# EAGLE board loa_v3.2 (EAGLE 6.5.0), part 1 of 2
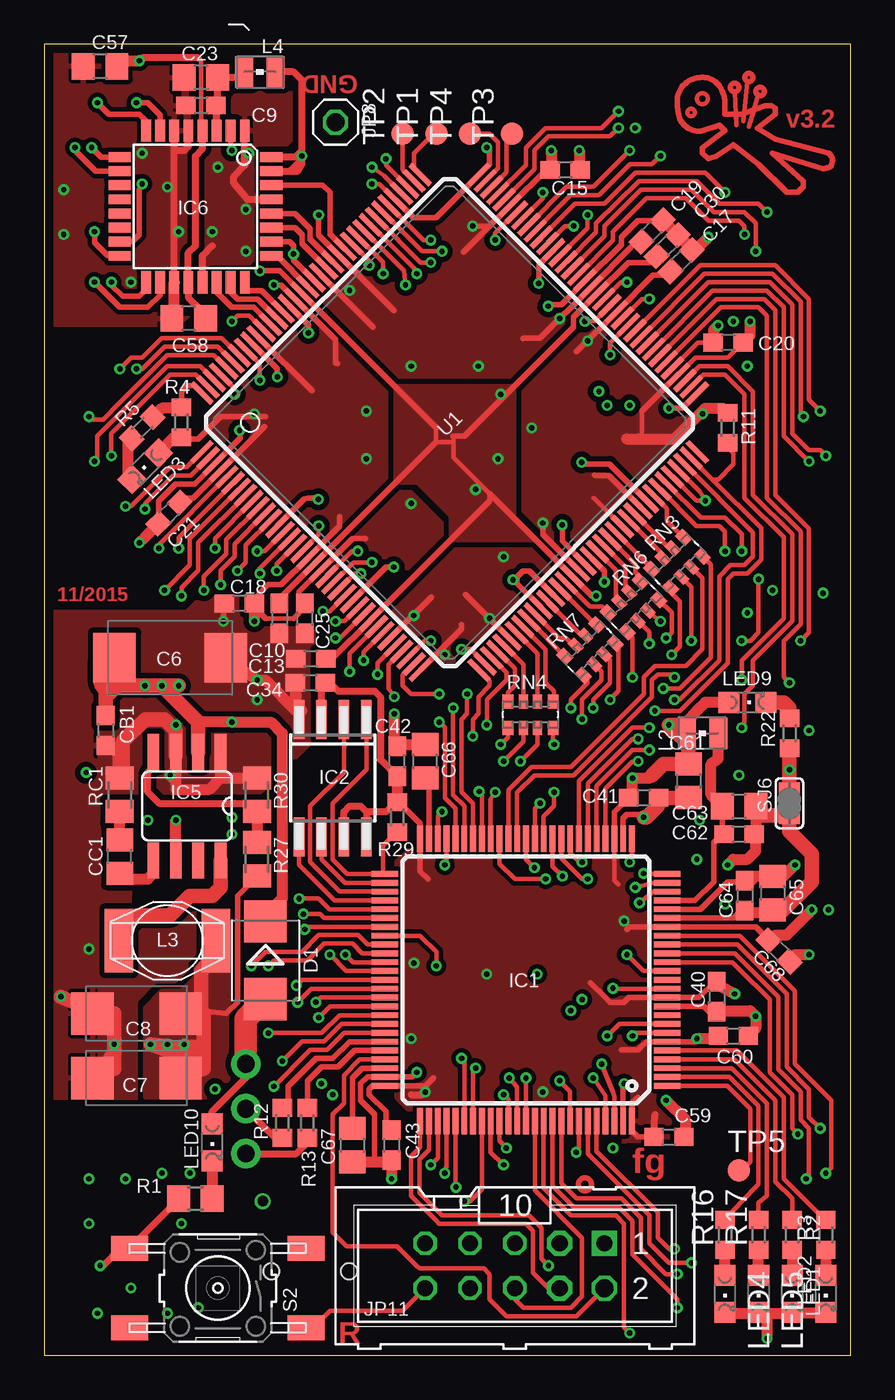
[diagram p7: board, top side]
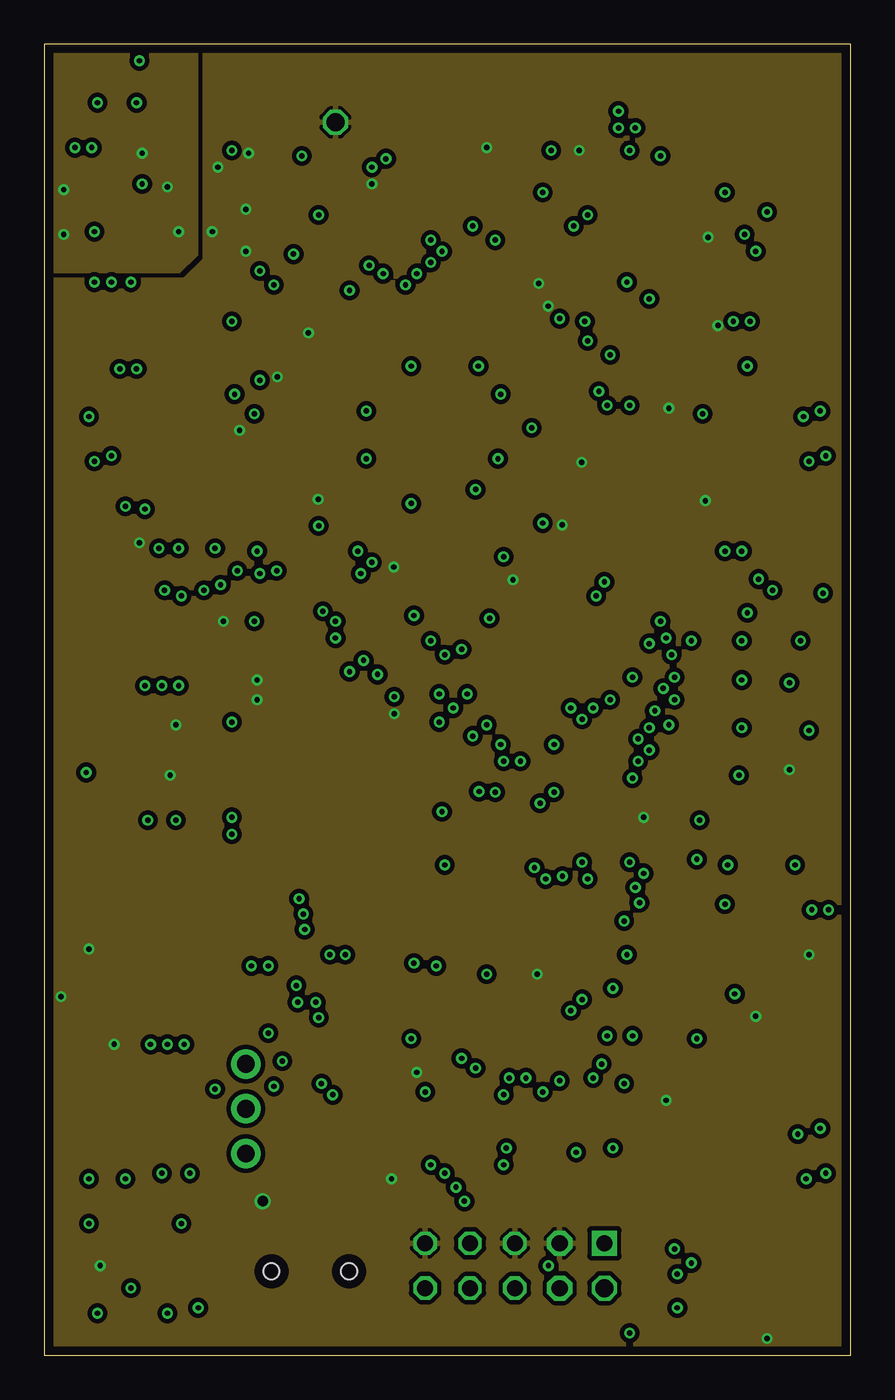
[diagram p8: board, inner layer GND]
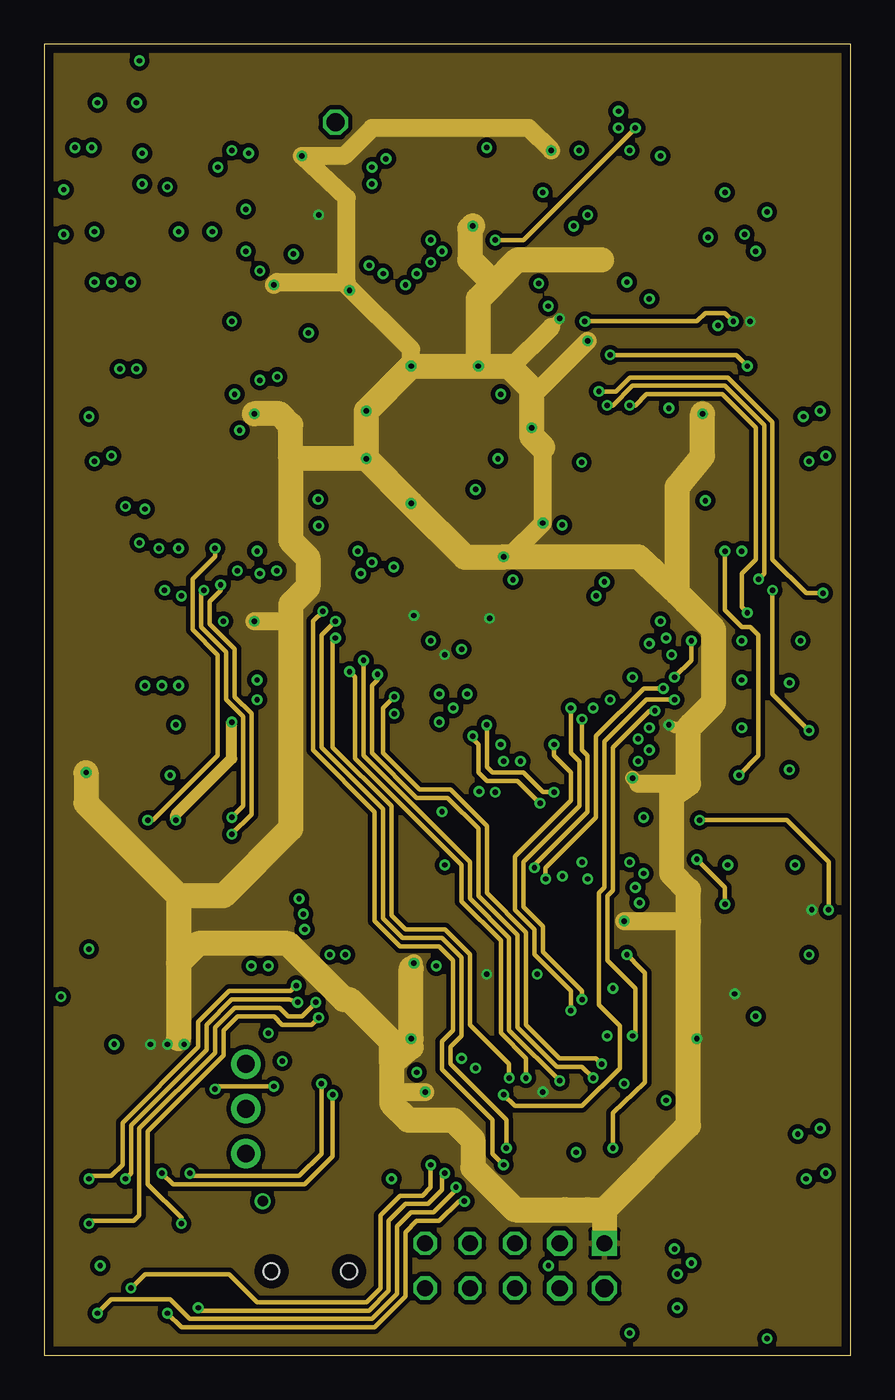
[diagram p9: board, inner layer Route15]
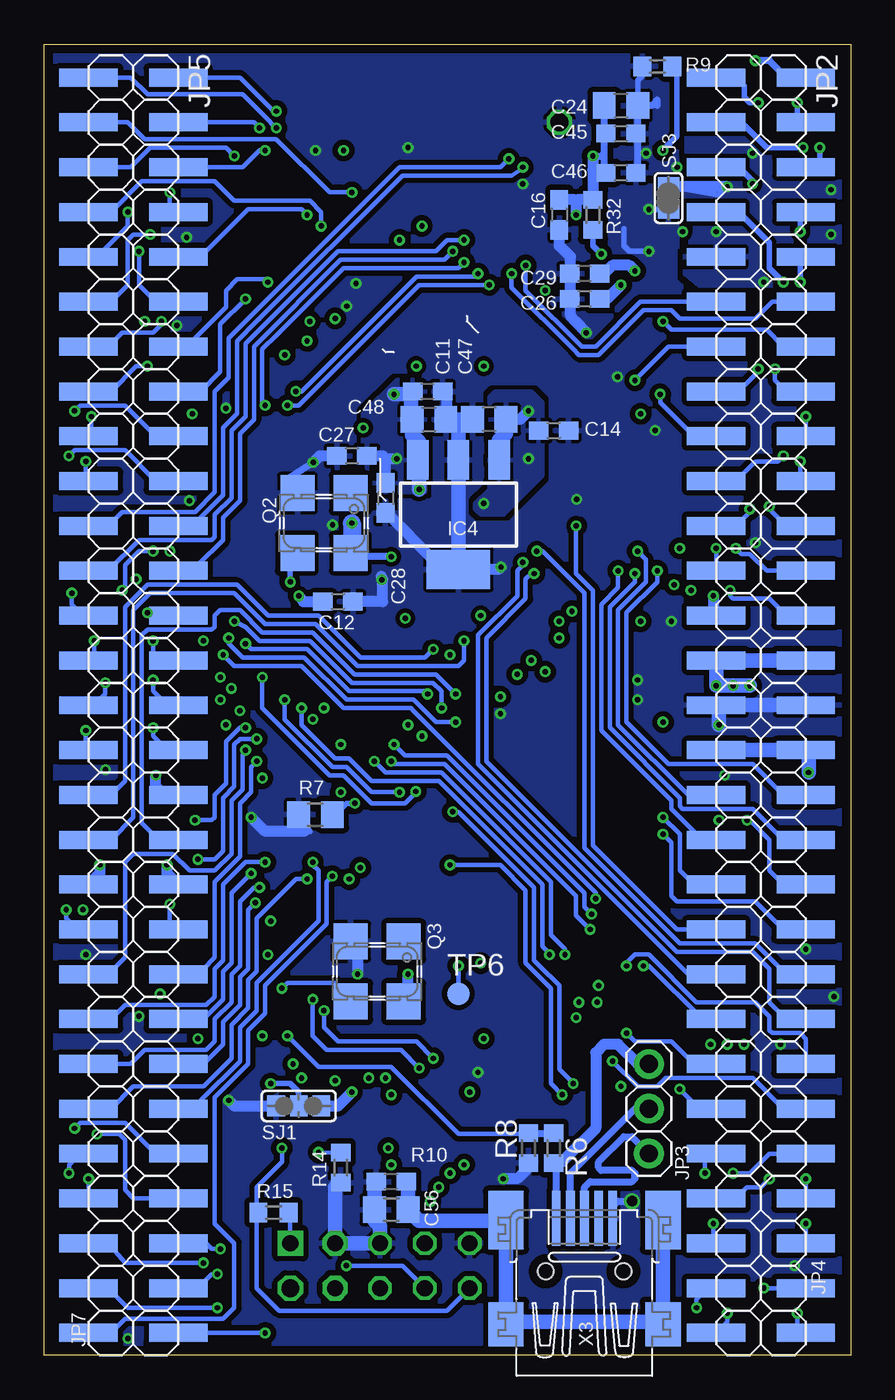
[diagram p10: board, bottom side, seen from below]

Size 45.7 x 74.28 mm. Coordinates in mm from the lower left corner, seen from the top.
Outline: 0,0 45.7,0 45.7,74.28 0,74.28 0,0
Copper layers (1+2*15+16): Top 0.035mm / dielectric 1.5mm / GND 0.035mm / dielectric 0.15mm / Route15 0.035mm / dielectric 0.2mm / Bottom 0.035mm
Design rules "PCB-POOL *": minimum track width 6mil, minimum drill 12mil, track to track 6mil, track to pad 6mil, pad to pad 6mil, via to via 6mil, smd to smd 6mil, copper to edge 20mil, drill to drill 8mil, minimum pad ring 8mil, minimum via ring 6mil, stop-mask expansion 12mil, vias tented up to drill 12mil, thermal gap 8mil

## Footprints (pad centres in the part's own frame; a part is rotated, then mirrored left to right if it is on the bottom)
SMC_D = smd 2.4 x 2.8: + -3.15,0; - 3.15,0
SMC_C = smd 2.4 x 2.4: + -2.5,0; - 2.5,0
C0603 = smd 1.1 x 1: 1 -0.85,0; 2 0.85,0
C0805 = smd 1.3 x 1.5: 1 -0.95,0; 2 0.95,0
SMB = smd 2.4 x 2.4: A 2.2,0; C -2.2,0
TQFP100 = smd 1.5 x 0.33: 1 -8,6; 2 -8,5.5; 3 -8,5; 4 -8,4.5; 5 -8,4; 6 -8,3.5; 7 -8,3; 8 -8,2.5; 9 -8,2; 10 -8,1.5; 11 -8,1; 12 -8,0.5; 13 -8,0; 14 -8,-0.5; 15 -8,-1; 16 -8,-1.5; 17 -8,-2; 18 -8,-2.5; 19 -8,-3; 20 -8,-3.5; 21 -8,-4; 22 -8,-4.5; 23 -8,-5; 24 -8,-5.5; 25 -8,-6; 51 8,-6; 52 8,-5.5; 53 8,-5; 54 8,-4.5; 55 8,-4; 56 8,-3.5; 57 8,-3; 58 8,-2.5; 59 8,-2; 60 8,-1.5; 61 8,-1; 62 8,-0.5; 63 8,0; 64 8,0.5; 65 8,1; 66 8,1.5; 67 8,2; 68 8,2.5; 69 8,3; 70 8,3.5; 71 8,4; 72 8,4.5; 73 8,5; 74 8,5.5; 75 8,6 | smd 0.33 x 1.5: 26 -6,-8; 27 -5.5,-8; 28 -5,-8; 29 -4.5,-8; 30 -4,-8; 31 -3.5,-8; 32 -3,-8; 33 -2.5,-8; 34 -2,-8; 35 -1.5,-8; 36 -1,-8; 37 -0.5,-8; 38 0,-8; 39 0.5,-8; 40 1,-8; 41 1.5,-8; 42 2,-8; 43 2.5,-8; 44 3,-8; 45 3.5,-8; 46 4,-8; 47 4.5,-8; 48 5,-8; 49 5.5,-8; 50 6,-8; 76 6,8; 77 5.5,8; 78 5,8; 79 4.5,8; 80 4,8; 81 3.5,8; 82 3,8; 83 2.5,8; 84 2,8; 85 1.5,8; 86 1,8; 87 0.5,8; 88 0,8; 89 -0.5,8; 90 -1,8; 91 -1.5,8; 92 -2,8; 93 -2.5,8; 94 -3,8; 95 -3.5,8; 96 -4,8; 97 -4.5,8; 98 -5,8; 99 -5.5,8; 100 -6,8
SO-08M = smd 0.6 x 2.2: 1 -1.905,-3.33; 2 -0.635,-3.33; 3 0.635,-3.33; 4 1.905,-3.33; 5 1.905,3.33; 6 0.635,3.33; 7 -0.635,3.33; 8 -1.905,3.33
SOT223 = smd 1.219 x 2.235: 1 -2.311,-3.099; 2 0,-3.099; 3 2.311,-3.099 | smd 3.6 x 2.2: 4 0,3.099
SO08 = smd 0.66 x 2.032: 1 -1.905,-3.073; 2 -0.635,-3.073; 3 0.635,-3.073; 4 1.905,-3.073; 5 1.905,3.073; 6 0.635,3.073; 7 -0.635,3.073; 8 -1.905,3.073
TQFP32-08 = smd 1.27 x 0.559: 1 -4.293,2.8; 2 -4.293,2; 3 -4.293,1.2; 4 -4.293,0.4; 5 -4.293,-0.4; 6 -4.293,-1.2; 7 -4.293,-2; 8 -4.293,-2.8; 17 4.293,-2.8; 18 4.293,-2; 19 4.293,-1.2; 20 4.293,-0.4; 21 4.293,0.4; 22 4.293,1.2; 23 4.293,2; 24 4.293,2.8 | smd 0.559 x 1.27: 9 -2.8,-4.293; 10 -2,-4.293; 11 -1.2,-4.293; 12 -0.4,-4.293; 13 0.4,-4.293; 14 1.2,-4.293; 15 2,-4.293; 16 2.8,-4.293; 25 2.8,4.293; 26 2,4.293; 27 1.2,4.293; 28 0.4,4.293; 29 -0.4,4.293; 30 -1.2,4.293; 31 -2,4.293; 32 -2.8,4.293
2X13SMD = smd 1.016 x 3.302: 1 -15.24,-2.54; 2 -15.24,2.54; 3 -12.7,-2.54; 4 -12.7,2.54; 5 -10.16,-2.54; 6 -10.16,2.54; 7 -7.62,-2.54; 8 -7.62,2.54; 9 -5.08,-2.54; 10 -5.08,2.54; 11 -2.54,-2.54; 12 -2.54,2.54; 13 0,-2.54; 14 0,2.54; 15 2.54,-2.54; 16 2.54,2.54; 17 5.08,-2.54; 18 5.08,2.54; 19 7.62,-2.54; 20 7.62,2.54; 21 10.16,-2.54; 22 10.16,2.54; 23 12.7,-2.54; 24 12.7,2.54; 25 15.24,-2.54; 26 15.24,2.54
1X03S = drill 1.016 pad 1.676: 1 -2.54,0; 2 0,0; 3 2.54,0
2X16SMD = smd 1.016 x 3.302: 1 -19.05,-2.54; 2 -19.05,2.54; 3 -16.51,-2.54; 4 -16.51,2.54; 5 -13.97,-2.54; 6 -13.97,2.54; 7 -11.43,-2.54; 8 -11.43,2.54; 9 -8.89,-2.54; 10 -8.89,2.54; 11 -6.35,-2.54; 12 -6.35,2.54; 13 -3.81,-2.54; 14 -3.81,2.54; 15 -1.27,-2.54; 16 -1.27,2.54; 17 1.27,-2.54; 18 1.27,2.54; 19 3.81,-2.54; 20 3.81,2.54; 21 6.35,-2.54; 22 6.35,2.54; 23 8.89,-2.54; 24 8.89,2.54; 25 11.43,-2.54; 26 11.43,2.54; 27 13.97,-2.54; 28 13.97,2.54; 29 16.51,-2.54; 30 16.51,2.54; 31 19.05,-2.54; 32 19.05,2.54
1X01 = drill 1.016 octagon: 1 0,0
ML10 = drill 0.914 pad 1.422 square: 1 -5.08,-1.27 | drill 1.016 pad 1.422 octagon: 2 -5.08,1.27 | drill 0.914 pad 1.422 octagon: 3 -2.54,-1.27; 4 -2.54,1.27 | drill 0.914 octagon: 5 0,-1.27; 6 0,1.27; 7 2.54,-1.27; 8 2.54,1.27; 9 5.08,-1.27; 10 5.08,1.27
WE-KI_0805_B = smd 1.02 x 1.78: 1 -0.89,0; 2 0.89,0
L-PISG = smd 1.6 x 3.6: 1 -2.75,0; 2 2.75,0
CHIPLED_0805 = smd 1.2 x 1.2: A 0,-1.05; C 0,1.05
XO53 = smd 1.93 x 2.032: 1 -1.5,-1.7; 2 1.5,-1.7; 3 1.5,1.7; 4 -1.5,1.7
R0805 = smd 1.3 x 1.5: 1 -0.95,0; 2 0.95,0
R0603 = smd 1 x 1.1: 1 -0.85,0; 2 0.85,0
M0805 = smd 1.3 x 1.6: 1 -0.95,0; 2 0.95,0
EXB38V = smd 0.6 x 0.8: 1 -1.275,-0.75; 4 1.275,-0.75; 5 1.275,0.75; 8 -1.275,0.75 | smd 0.5 x 0.8: 2 -0.4,-0.75; 3 0.4,-0.75; 6 0.4,0.75; 7 -0.4,0.75
B3F-10XX-SMD = smd 2.1 x 1.4: P1 -5,2.25; P2 5,2.25; P3 -5,-2.25; P4 5,-2.25
SJ_2S = smd 1 x 1.2: 1 -1.286,0; 2 0,0; 3 1.286,0
SJS = smd 1 x 1.2: 1 -0.683,0; 2 0.683,0
B1,27 = smd 1.27 x 1.27: TP 0,0
TQ144 = smd 1.6 x 0.3: P1 -11.1,8.75; P2 -11.1,8.25; P3 -11.1,7.75; P4 -11.1,7.25; P5 -11.1,6.75; P6 -11.1,6.25; P7 -11.1,5.75; P8 -11.1,5.25; P9 -11.1,4.75; P10 -11.1,4.25; P11 -11.1,3.75; P12 -11.1,3.25; P13 -11.1,2.75; P14 -11.1,2.25; P15 -11.1,1.75; P16 -11.1,1.25; P17 -11.1,0.75; P18 -11.1,0.25; P19 -11.1,-0.25; P20 -11.1,-0.75; P21 -11.1,-1.25; P22 -11.1,-1.75; P23 -11.1,-2.25; P24 -11.1,-2.75; P25 -11.1,-3.25; P26 -11.1,-3.75; P27 -11.1,-4.25; P28 -11.1,-4.75; P29 -11.1,-5.25; P30 -11.1,-5.75; P31 -11.1,-6.25; P32 -11.1,-6.75; P33 -11.1,-7.25; P34 -11.1,-7.75; P35 -11.1,-8.25; P36 -11.1,-8.75; P73 11.1,-8.75; P74 11.1,-8.25; P75 11.1,-7.75; P76 11.1,-7.25; P77 11.1,-6.75; P78 11.1,-6.25; P79 11.1,-5.75; P80 11.1,-5.25; P81 11.1,-4.75; P82 11.1,-4.25; P83 11.1,-3.75; P84 11.1,-3.25; P85 11.1,-2.75; P86 11.1,-2.25; P87 11.1,-1.75; P88 11.1,-1.25; P89 11.1,-0.75; P90 11.1,-0.25; P91 11.1,0.25; P92 11.1,0.75; P93 11.1,1.25; P94 11.1,1.75; P95 11.1,2.25; P96 11.1,2.75; P97 11.1,3.25; P98 11.1,3.75; P99 11.1,4.25; P100 11.1,4.75; P101 11.1,5.25; P102 11.1,5.75; P103 11.1,6.25; P104 11.1,6.75; P105 11.1,7.25; P106 11.1,7.75; P107 11.1,8.25; P108 11.1,8.75 | smd 0.3 x 1.6: P37 -8.75,-11.1; P38 -8.25,-11.1; P39 -7.75,-11.1; P40 -7.25,-11.1; P41 -6.75,-11.1; P42 -6.25,-11.1; P43 -5.75,-11.1; P44 -5.25,-11.1; P45 -4.75,-11.1; P46 -4.25,-11.1; P47 -3.75,-11.1; P48 -3.25,-11.1; P49 -2.75,-11.1; P50 -2.25,-11.1; P51 -1.75,-11.1; P52 -1.25,-11.1; P53 -0.75,-11.1; P54 -0.25,-11.1; P55 0.25,-11.1; P56 0.75,-11.1; P57 1.25,-11.1; P58 1.75,-11.1; P59 2.25,-11.1; P60 2.75,-11.1; P61 3.25,-11.1; P62 3.75,-11.1; P63 4.25,-11.1; P64 4.75,-11.1; P65 5.25,-11.1; P66 5.75,-11.1; P67 6.25,-11.1; P68 6.75,-11.1; P69 7.25,-11.1; P70 7.75,-11.1; P71 8.25,-11.1; P72 8.75,-11.1; P109 8.75,11.1; P110 8.25,11.1; P111 7.75,11.1; P112 7.25,11.1; P113 6.75,11.1; P114 6.25,11.1; P115 5.75,11.1; P116 5.25,11.1; P117 4.75,11.1; P118 4.25,11.1; P119 3.75,11.1; P120 3.25,11.1; P121 2.75,11.1; P122 2.25,11.1; P123 1.75,11.1; P124 1.25,11.1; P125 0.75,11.1; P126 0.25,11.1; P127 -0.25,11.1; P128 -0.75,11.1; P129 -1.25,11.1; P130 -1.75,11.1; P131 -2.25,11.1; P132 -2.75,11.1; P133 -3.25,11.1; P134 -3.75,11.1; P135 -4.25,11.1; P136 -4.75,11.1; P137 -5.25,11.1; P138 -5.75,11.1; P139 -6.25,11.1; P140 -6.75,11.1; P141 -7.25,11.1; P142 -7.75,11.1; P143 -8.25,11.1; P144 -8.75,11.1
32005-201 = smd 3.1 x 0.5: 1 3,1.6; 2 3,0.8; 3 3,0; 4 3,-0.8; 5 3,-1.6 | smd 2.5 x 2: M1 -3,-4.45; M2 -3,4.45 | smd 3.3 x 2: M3 2.9,4.45; M4 2.9,-4.45 | hole 0.9: 0,2.2; 0,-2.2

## Placement (x,y rotation side)
C6  22µ  [SMC_D]  7.14,39.53 0 top
C7  22µ  [SMC_C]  5.24,15.72 180 top
C8  22µ  [SMC_C]  5.24,19.37 180 top
C9  100n  [C0603]  8.89,70.8 180 top
C10  10n  [C0603]  13.34,41.75 270 top
C11  10n  [C0603]  23.97,54.61 0 bottom
C12  10n  [C0603]  29.05,42.7 0 bottom
C13  10n  [C0603]  15.11,39.46 180 top
C14  100n  [C0603]  16.83,52.39 0 bottom
C15  100n  [C0603]  29.53,67.15 0 top
C16  100n  [C0603]  16.51,64.61 270 bottom
C17  100n  [C0603]  36.1,62.01 45 top
C18  100n  [C0603]  11.07,42.59 180 top
C19  100n  [C0603]  34.45,63.69 45 top
C20  100n  [C0603]  38.76,57.38 180 top
C21  100n  [C0603]  7.08,47.72 225 top
C23  1µ  [C0805]  8.89,72.39 180 top
C24  1µ  [C0805]  13.02,70.8 0 bottom
C25  100n  [C0603]  14.76,41.75 270 top
C26  100n  [C0603]  15.08,59.85 180 bottom
C27  100n  [C0603]  28.26,50.96 180 bottom
C28  100n  [C0603]  26.35,48.58 270 bottom
C29  100n  [C0603]  15.08,61.28 180 bottom
C30  100n  [C0603]  35.31,62.87 45 top
C34  100n  [C0603]  15.08,38.1 180 top
C40  100n  [C0603]  38.1,20.32 270 top
C41  100n  [C0603]  33.97,31.59 0 top
C42  100n  [C0603]  20,33.66 90 top
C43  100n  [C0603]  19.68,11.91 270 top
C45  100n  [C0603]  13.02,69.22 0 bottom
C46  100n  [C0603]  13.02,66.99 0 bottom
C47  4µ7  [C0805]  20.48,53.02 180 bottom
C48  1µ  [C0805]  23.89,53.02 0 bottom
C56  10n  [C0603]  26.04,9.84 180 bottom
C57  1µ  [C0805]  3.18,73.03 180 top
C58  1µ  [C0805]  8.19,58.74 180 top
C59  100n  [C0603]  35.4,12.38 0 top
C60  100n  [C0603]  39.05,18.1 0 top
C61  4µ7  [C0805]  36.51,32.54 270 top
C62  10n  [C0603]  39.37,29.53 0 top
C63  1µ  [C0805]  39.37,31.12 0 top
C64  10n  [C0603]  39.69,26.04 270 top
C65  1µ  [C0805]  41.27,26.19 270 top
C66  4µ7  [C0805]  21.59,33.66 90 top
C67  4µ7  [C0805]  17.46,11.91 270 top
C68  100n  [C0603]  41.64,22.91 315 top
CB1  100n  [C0603]  3.49,35.4 270 top
CC1  6n8  [C0805]  4.29,28.26 90 top
D1  MURS 140  [SMB]  12.54,22.38 270 top
IC1  STM32F10XVXT6  [TQFP100]  27.3,21.27 180 top
IC2  M25P80MW  [SO-08M]  16.35,32.7 180 top
IC4  MCP1825S-1202E/DB  [SOT223]  22.23,47.62 180 bottom
IC5  NCP3170  [SO08]  8.1,31.11 180 top
IC6  AD7265SU  [TQFP32-08]  8.57,65.09 270 top
JP2  [2X13SMD]  5.08,57.15 270 bottom
JP3  [1X03S]  11.43,13.97 270 bottom
JP4  [2X16SMD]  5.08,20.32 270 bottom
JP5  [2X13SMD]  40.64,57.15 270 bottom
JP7  [2X16SMD]  40.64,20.32 270 bottom
JP8  GND  [1X01]  16.51,69.85 0 top
JP11  CORTEX_JTAGW  [ML10]  26.67,5.08 180 top
L2  0,47u  [WE-KI_0805_B]  37.31,35.24 0 top
L3  4µ7  [L-PISG]  6.99,23.5 0 top
L4  0,47u  [WE-KI_0805_B]  12.22,72.71 180 top
LED1  Red  [CHIPLED_0805]  42.39,3.49 180 top
LED2  Yellow  [CHIPLED_0805]  44.29,3.49 180 top
LED3  Green  [CHIPLED_0805]  5.73,50.37 135 top
LED4  Red  [CHIPLED_0805]  38.58,3.49 180 top
LED5  Yellow  [CHIPLED_0805]  40.48,3.49 180 top
LED9  Green  [CHIPLED_0805]  39.85,36.99 270 top
LED10  Blue  [CHIPLED_0805]  9.53,12.06 180 top
Q2  50.000  [XO53]  29.84,47.15 180 bottom
Q3  25.000  [XO53]  26.83,21.75 180 bottom
R1  2k2  [R0805]  8.57,8.89 0 top
R2  330  [R0603]  42.39,6.83 90 top
R3  330  [R0603]  44.29,6.83 90 top
R4  10k  [R0603]  7.78,52.86 270 top
R5  330  [R0603]  5.56,52.55 225 top
R6  1k  [R0603]  16.83,11.75 270 bottom
R7  2k2  [R0805]  30.32,30.64 0 bottom
R8  2k2  [R0603]  18.26,11.75 90 bottom
R9  10k  [R0603]  10.95,73.03 0 bottom
R10  1M  [R0805]  26.03,8.26 0 bottom
R11  330  [R0603]  38.73,52.55 90 top
R12  22  [R0603]  13.49,13.18 270 top
R13  22  [R0603]  14.92,13.18 270 top
R14  100k  [R0603]  28.89,10.64 90 bottom
R15  2k2  [R0603]  32.7,8.1 0 bottom
R16  330  [R0603]  38.58,6.83 90 top
R17  330  [R0603]  40.48,6.83 90 top
R22  330  [R0603]  42.23,35.24 90 top
R27  24k9  [M0805]  12.07,28.1 270 top
R29  10k  [R0603]  20,30.48 90 top
R30  8k06  [M0805]  12.07,31.75 270 top
R32  10k  [R0603]  14.61,64.61 90 bottom
RC1  4k99  [M0805]  4.29,31.75 270 top
RN3  100  [EXB38V]  35.87,44.9 45 top
RN4  100  [EXB38V]  27.56,36.3 0 top
RN6  100  [EXB38V]  33.4,42.43 45 top
RN7  100  [EXB38V]  30.93,39.96 45 top
S2  Reset  [B3F-10XX-SMD]  9.84,3.81 180 top
SJ1  PDR_ON  [SJ_2S]  31.27,14.13 0 bottom
SJ3  AGND-GND  [SJS]  10.32,65.56 270 bottom
SJ6  [SJS]  42.23,31.27 270 top
TP1  TPB1,27  [B1,27]  22.23,69.22 90 top
TP2  TPB1,27  [B1,27]  20.32,69.22 90 top
TP3  TPB1,27  [B1,27]  26.51,69.22 90 top
TP4  TPB1,27  [B1,27]  24.13,69.22 90 top
TP5  TPB1,27  [B1,27]  39.37,10.48 0 top
TP6  TPB1,27  [B1,27]  22.23,20.48 0 bottom
U1  6SLX9TQG144  [TQ144]  22.98,52.85 45 top
X3  MINI-USB  [32005-201]  15.08,4.76 90 bottom

## Tracks (layer width: path | path; a pad name or v marks a point on that pad's centre or on a via)
!ADC_CS  (via drill 0.3)
  Top 0.305: U1.P126 14.13,62.05 14.13,62.87 | 14.13,62.87 13.91,63.09 IC6.26 | 14.13,62.87 14.13,62.71 v14.13,62.39
  Bottom 0.305: v14.13,62.39 14.61,62.87 R32.1 14.61,63.82
!RESET  (via drill 0.3)
  Top 0.254: IC1.14 33.95,21.77 v33.02,22.7 | S2.P1 15.21,1.56 16.19,2.54 20.32,2.54 JP11.10
  Route15 0.254: v32.23,11.75 32.23,13.73 34.05,15.48 34.05,21.67 33.81,21.91 v33.02,22.7
  Bottom 0.254: v32.23,11.75 32.23,10.95 33.66,9.53 33.66,8.26 | 33.66,8.26 33.66,8.2 | 33.66,8.2 R15.1 33.55,8.15 33.66,8.26 | 33.66,8.2 33.66,3.81 32.38,2.54 22.86,2.54 JP11.10
+3V1
  Top 0.254: 40.48,71.44 39.93,69.61 40.24,70.56 40.38,70.62 | 39.85,72.15 39.61,69.93 39.65,70.37 | 39.13,71.6 39.21,69.69 39.21,70.33 38.89,70.33
  Top 0.305: 38.58,70.33 39.53,70.33 39.65,70.37 39.77,70.41 40.38,70.62 40.88,70.8 41.2,70.8 41.43,70.64 41.43,70.33 40.4,69.53 41.43,68.9 44.45,68.1 arc-37 44.69,67.71 44.61,67.39 arc-37 44.13,67.23 41.27,68.1 43.02,66.52 43.02,66.2 42.7,65.88 42.07,65.88 40.48,67.47 39.05,68.58 38.1,67.94 37.62,67.79 37.31,68.1 37.31,68.42 38.58,69.37 38.26,69.69 37.31,69.37 arc-74 36.04,70.01 arc-23 35.88,71.28 arc-74 37.15,72.39 arc-60 38.26,71.91 arc-30 38.58,70.96 38.58,70.33 | 38.58,70.33 | 38.58,70.33 38.89,70.33
+3V3  (via drill 0.3)
  Top 0.254: IC1.28 32.3,26.91 32.54,26.67 | 14.41,42.03 14.45,42.23 | C18.1 11.91,42.7 | C21.1 7.94,48.58 | 12.54,41.75 14.13,41.75 | U1.P60 31.14,48.58 31.11,48.58 | U1.P76 36.89,56.52 38.73,56.52 39.46,57.24 C20.1 39.62,57.4 39.69,57.47 | 41.12,23.5 40.96,23.65 C68.1 41.5,23.97 41.43,23.81 | C60.1 38.2,18.04 38.1,17.94 | 33.87,53.49 33.87,52.12 33.66,51.91
  Top 0.305: 18.2,46.28 17.47,46.28 U1.P20 14.45,43.26 14.45,42.23 | 16.74,47.52 16.74,46.97 U1.P18 13.43,43.66 12.7,43.66 11.75,42.7 11.91,42.7 | 12.5,52.63 U1.P4 8.45,48.58 7.94,48.58 | U1.P135 15.17,54.65 | 16.62,56.17 16.51,56.2 16.51,57.55 U1.P129 13.42,60.64 v13.02,60.64 | 18.65,58.24 U1.P125 | 19.83,59.18 17.02,61.99 U1.P122 15.56,63.45 v15.56,64.61 | 23.77,62.49 U1.P103 | 33.87,53.49 U1.P76 | 30.16,56.85 U1.P86 34.5,61.2 35.16,61.2 35.37,61.4 C17.1 | 27.13,57.61 27.15,57.63 28.1,57.63 U1.P90 33.25,62.77 C19.1 | U1.P63 31.99,49.85 31.27,49.85 31.17,49.88 | U1.P53 28.26,46.51 28.26,47.31 28.21,47.19 | U1.P42 23.87,43.12 | U1.P36 23.65,41.15 23.65,41.4 | U1.P31 21.94,42.97 | 8.89,19.53 10.32,19.37 10.95,20 10.95,26.04 R27.2 | 14.61,67.79 13.91,67.09 | R29.2 20,31.43 21.3,30.13 IC1.50 21.3,27.42 21.75,26.99 | 33.66,14.61 33.3,14.32 IC1.100 33.3,12.73 33.66,12.38 C59.1 | 32.7,17.3 33.66,17.3 33.81,17.46 34.12,17.77 IC1.6 36.92,17.77 C60.1 | 30.96,21.11 31.8,20.27 32.07,20 32.86,20 33.13,20.27 IC1.11 37.1,20.27 37.94,21.11 38.04,21.11 C40.1 | 33.02,24.13 33.16,24.27 IC1.19 40.34,24.27 40.96,23.65 | 22.07,15.72 21.62,15.27 IC1.75 18.61,15.27 18.41,15.08 18.41,14.76 19.37,13.81 19.37,13.07 C43.1 | U1.P103 28.51,67.22 C15.1 | C25.1 14.41,42.03 | IC1.28 32.3,30.77 C41.1 | C18.1 11.75,42.55 12.06,42.23 12.54,41.75 | 14.13,41.75 14.76,42.39 | R4.2 7.62,51.91 | 7.62,51.91 | 7.62,51.91 8.73,51.91 10,53.18 12.54,53.18 | U1.P103 25.26,63.98 v24.29,63.98
  Top 0.406: v14.61,67.94 14.55,67.89 14.61,67.83 v14.61,67.94 | IC6.31 13.91,67.09 14.22,67.09 | 14.22,67.09 14.38,67.09 14.61,67.47 | v14.61,67.94 14.61,68.26 | IC6.32 14.23,67.89 14.61,68.26 | C59.1 34.55,12.48 34.61,13.65 | 15.72,35.82 IC2.3 15.72,38.1 15.88,38.26 C34.1 16.03,38.26 16.67,37.62 18.73,37.62 19.05,37.31 19.05,33.76 C42.1 | IC2.7 16.99,30.8 17.3,31.11 17.94,31.11 18.26,30.8 | 18.26,30.8 IC2.8 | R29.2 19.9,31.33 19.37,30.8 18.26,30.8 | 20.8,14.76 21.43,14.76 v21.59,14.92 | 14.22,67.09 14.61,67.47 | 14.61,67.47 v14.61,67.94 | 7.94,17.46 v6.99,17.62 | 14.61,68.26 14.61,72.23 14.13,72.71 L4.1 | L4.1
  Top 0.61: R29.2 C42.1 19.95,32.86 | C41.1 33.18,31.65 33.18,31.59 33.34,31.75 v33.34,32.7 34.29,32.7 34.45,32.86 | 36.42,35.72 36.42,35.88 37.05,36.58 37.47,36.99 LED9.A | C7.+ 8.37,16.39 8.26,16.51 v6.03,17.62 | R11.2 38.47,53.66 37.47,53.66 35.72,51.91 33.66,51.91 33.02,51.91 | v28.73,68.26 28.73,68.1 28.73,67.31 28.87,67.29 C15.1 | 14.76,42.39 C25.1 | C18.1 11.92,42.55 11.91,42.55 v11.91,41.59 | R4.2 7.38,52.01 LED3.A | 41.12,23.5 41.43,23.81 42.07,23.81 v43.5,25.24 | 39.69,57.47 40.01,57.78 v40.01,58.58 | C40.1 38.1,21.11 38.26,20.95 v39.13,20.48 | 38.26,17.94 38.1,17.94 v36.99,17.94
  Top 0.813: L3.2 9.58,22.59 8.89,21.75 8.89,19.53 8.57,19.25 C8.+ 9.05,19.37 9.05,17.46 | 9.05,16.51 9.05,16.23 C7.+ | 9.05,16.51 9.05,17.46 | C61.1 35.08,33.5 34.45,32.86 | C61.1 36.51,34.77 36.04,35.08 v35.4,35.72 36.42,35.72 L2.1 | C61.1 36.51,33.34 | 9.05,17.46 7.94,17.46 7.46,17.46 v6.03,17.62 9.05,16.51
  Route15 0.406: 7.62,17.94 7.62,18.1 v6.99,17.62
  Route15 0.61: v29.21,58.74 28.73,58.26 | 28.73,58.26 | 36.67,35.72 36.51,35.56 35.72,35.56 v35.4,35.72
  Route15 0.813: 26.01,45.22 v26.04,45.24 26.35,45.24 | v33.34,32.7 33.66,32.38
  Route15 1.016: 26.35,45.24 v28.26,47.15 | v28.26,47.15 28.26,51.44 | 19.68,14.92 v21.59,14.92 | v20.8,56.04 20.8,56.99 17.14,60.64 17.14,60.8 | 17.14,60.8 17.14,65.56 v14.61,67.94 16.99,67.94 18.57,69.53 27.46,69.53 v28.73,68.26 | v13.02,60.64 13.18,60.8 17.14,60.8 | 28.73,58.26 26.35,55.88 26.35,56.04 | v30.8,57.47 27.62,54.29 27.62,54.77 | v32.86,24.61 36.51,24.61 | v20.8,17.94 20.8,17.46 | 33.66,32.38 36.51,32.38 | v28.26,47.15 | 20.8,21.91 v20.95,22.23 | v11.91,41.59 13.81,41.59 13.97,41.43
  Route15 1.422: 26.01,45.22 23.84,45.22 v20.8,48.26 v18.26,50.8 | 28.26,51.44 27.62,52.07 v27.62,52.55 27.62,54.77 26.35,56.04 25.88,56.04 v24.61,56.04 | v24.61,56.04 v20.8,56.04 v18.26,53.5 v18.26,50.8 | 31.75,8.26 36.51,13.02 36.51,24.61 36.51,26.35 35.56,27.3 35.56,31.75 36.51,32.38 36.51,35.56 36.67,35.72 37.94,36.99 37.94,39.21 37.94,41.12 36.35,42.7 | 31.75,8.26 30.8,8.26 29.53,8.26 26.67,8.26 24.29,10.64 24.29,12.22 23.18,13.34 20.64,13.34 19.68,14.29 19.68,14.92 19.68,16.51 | 36.35,42.7 33.66,45.24 32.54,45.24 v26.04,45.24 | 31.75,8.26 JP11.1 | v18.26,50.8 13.97,50.8 | 13.97,50.8 13.97,46.16 U1.P18 14.95,43.52 13.97,42.55 13.97,41.43 13.97,29.84 10.16,26.04 7.62,26.04 | 13.97,50.8 13.97,52.7 13.34,53.34 v11.91,53.34 | 20.8,17.46 19.68,16.51 | v20.8,17.94 20.8,21.91 | 19.68,16.51 19.68,17.78 17.3,20.16 16.99,20.16 13.81,23.34 8.73,23.34 7.62,22.23 | 7.62,22.23 7.62,17.94 | v2.38,33.02 2.38,31.27 7.62,26.04 | 7.62,26.04 7.62,22.23 | v24.61,56.04 24.61,59.85 25.48,60.72 | 25.48,60.72 26.83,62.07 31.59,62.07 | 36.35,42.7 35.88,43.18 35.88,49.21 37.31,50.96 v37.31,53.34 | v24.29,63.98 24.13,63.82 24.13,62.07 25.48,60.72
  Bottom 0.254: R15.2 31.85,8.15 31.75,8.26 JP11.1
  Bottom 0.406: Q2.4 28.3,45.24 v26.04,45.24 | C24.1 13.97,69.32 | 13.97,69.32 C45.1 | 13.97,69.32 13.97,68.1 | 13.97,68.1 13.97,67.09 C46.1 | v14.61,67.94 14.13,67.94 13.97,68.1
  Bottom 0.61: v14.61,67.94 14.61,67.15 R32.2 15.5,65.46 15.56,65.41 | v18.26,53.5 18.73,53.02 C47.1 | C26.1 13.81,59.85 v13.02,60.64 | 15.56,65.41 v15.56,64.61 | 15.56,65.41 15.61,65.46 C16.1 | v25.08,21.59 25.08,20.32 25.08,20.3 Q3.4 | SJ1.3 29.05,14.13 v28.26,14.92
  Bottom 0.813: IC4.1 19.91,51.84 19.53,52.23 C47.1 | JP4.5 JP4.6 2.38,34.13 v2.38,33.02
  Bottom 1.016: v28.26,47.15 28.26,46.04 28.57,45.72
  other vias: 17.3,60.33 22.7,39.69 20.96,41.91 25.24,41.75 7.94,17.62
  pour Top (isolate 0.305, rank 6): 23.42,39.38 22.53,39.38 9.51,52.4 9.51,53.3 22.53,66.32 23.42,66.32 36.45,53.3 36.45,52.4
  pour Top (isolate 0.254): 20.64,13.97 20,14.61 20,27.94 20.64,28.57 33.97,28.57 34.61,27.94 34.61,14.29 35.56,13.34 35.56,12.38 34.92,11.75 33.02,11.75 30.8,13.97
  pour Bottom (isolate 0.254, rank 5): 17.46,49.85 17.46,53.98 18.1,54.61 20.16,54.61 20.48,54.29 20.48,49.05 21.27,48.26 21.27,47.94 20.95,47.62 19.68,47.62
  pour Route15 (isolate 0.254, rank 6): -1.27,75.56 46.99,75.56 46.99,-0.64 -1.27,-0.64
  pour Top (isolate 0.305, rank 2, no thermals): 9.05,23.5 10.32,23.5 10.32,21.75 10.48,21.59 10.48,14.92 10.16,14.61 5.71,14.61 5.71,19.68 6.67,20.64 7.78,20.64 8.57,21.43 8.57,21.91 9.05,22.38
ADC_A0
  Top 0.305: U1.P127 13.19,62.29 IC6.25
ADC_A1
  Top 0.305: U1.P131 12.32,60.33 11.59,60.33 11.37,60.54 IC6.24
ADC_A2
  Top 0.305: U1.P132 12.09,59.85 10.95,59.85 10.57,60.23 IC6.23
ADC_CLK
  Top 0.305: U1.P124 14.61,62.99 14.61,63.5 14.22,63.89 IC6.27
ADC_DOUTA
  Top 0.305: U1.P121 16.19,63.52 16.19,65.88 15.79,66.29 IC6.30
ADC_DOUTB
  Top 0.305: U1.P123 15.08,63.22 15.08,63.82 14.21,64.69 IC6.28
ADC_SGL_DIFF
  Top 0.305: U1.P133 11.86,59.37 10.64,59.37 9.77,60.24 IC6.22
AGND  (via drill 0.3)
  Top 0.406: IC6.5 8.17,68.5 7.94,68.26 7.38,68.26 7.38,69.65 IC6.6 IC6.19
  Top 0.61: IC6.19 7.37,59.44 7.14,59.21
  Bottom 0.305: SJ3.1 7.46,65.72 v6.99,66.2
  Bottom 0.61: v6.99,66.2 10.16,66.2 10.32,66.36
  other vias: 5.56,68.1 7.62,63.66 1.11,66.04 4.92,60.8 1.11,63.5
  pour Top (isolate 0.254, rank 5): -0.64,74.61 8.57,74.61 8.57,59.37 7.62,58.42 -0.64,58.42
  pour GND (isolate 0.254, rank 5): -1.91,76.2 6.35,76.36 8.57,76.36 8.57,62.39 7.62,61.44 -1.91,61.44
  pour Bottom (isolate 0.254, rank 5): -0.64,74.93 9.21,74.93 9.37,61.44 9.37,61.28 8.57,60.64 -0.64,60.64
DONE  (via drill 0.3)
  Top 0.254: IC1.7 33.51,18.27 v33.34,18.1 | 37.87,49.62 U1.P71 | 37.87,49.62 40.64,46.85 40.64,45.09 39.85,44.29 39.05,44.29 38.73,43.97 38.73,39.21 36.04,36.51 v34.61,36.51 | R11.1 38.58,51.59 39.05,51.12 39.05,50.48 38.19,49.62 37.87,49.62
  Route15 0.254: v33.34,18.1 33.5,18.26 33.5,20.8 31.91,22.38 31.91,26.04 32.23,26.35 32.23,34.45 34.29,36.51 v34.61,36.51
FPGA_CLK  (via drill 0.3)
  Top 0.305: U1.P55 31.75,44.43 v31.75,43.81
  Bottom 0.305: Q2.3 31.27,45.45 U1.P55 31.5,45.18 31.75,44.93 v31.75,43.81
FPGA_TCK
  Top 0.254: U1.P109 20.95,67.25 20.95,68.1 22.07,69.22 TP1.TP
FPGA_TDI
  Top 0.254: U1.P110 20.32,67.17 TP2.TP
FPGA_TDO
  Top 0.254: U1.P106 26.19,67.03 26.19,68.9 TP3.TP
FPGA_TMS
  Top 0.254: U1.P107 25.72,67.26 25.72,68.74 25.24,69.22 TP4.TP
FSMC_CLK  (via drill 0.3)
  Top 0.254: IC1.84 25.3,11.49 v26.04,10.79 | U1.P24 16.16,42.15 v15.8,42.15
  Route15 0.254: v26.04,10.79 25.72,11.11 25.4,11.43 25.4,12.86 | 25.4,12.86 | 25.4,12.86 25.4,13.34 22.54,16.19 22.54,17.78 23.18,18.41 23.18,22.38 22.38,23.18 20.16,23.18 18.73,24.61 18.73,30.8 15.24,34.29 15.24,41.59 v15.8,42.15
FSMC_D0  (via drill 0.3)
  Top 0.254: v17.07,22.7 17.14,22.62 17.49,22.27 IC1.61 | v31.11,36.67 31.11,37.15 32.07,38.1 32.07,39.39 RN7.3
  Bottom 0.254: v17.07,22.7 17.07,22.78 17.46,23.18 17.46,26.67 23.34,32.54 27.15,32.54 28.42,33.81 29.21,33.81 31.11,35.72 v31.11,36.67
FSMC_D1  (via drill 0.3)
  Top 0.254: IC1.62 17.12,21.77 v16.19,22.7 | v26.99,33.66 27.94,34.61 27.94,35.53 RN4.3
  Bottom 0.254: v16.19,22.7 16.19,23.02 16.99,23.81 16.99,26.83 23.18,33.02 26.35,33.02 v26.99,33.66
FSMC_D2  (via drill 0.3)
  Top 0.254: IC1.81 23.8,16.68 v23.65,16.83 | RN4.4 28.83,34.67 v28.89,34.61
  Route15 0.254: v29.84,19.53 29.84,20.64 27.78,22.7 27.78,24.13 26.67,25.24 26.67,28.26 29.84,31.43 29.84,33.02 28.89,33.97 v28.89,34.61
  Bottom 0.254: v29.84,19.53 29.84,19.37 29.84,19.05 29.84,18.57 29.05,17.78 24.61,17.78 v23.65,16.83
FSMC_D3  (via drill 0.3)
  Top 0.254: IC1.82 24.3,16.13 v24.45,16.27 | v29.84,36.67 29.84,37.15 30.8,38.1 30.8,38.29 RN7.1
  Route15 0.254: v30.48,20.16 30.48,20.64 28.26,22.86 28.26,24.29 27.15,25.4 27.15,27.94 30.32,31.11 30.32,32.23 30.32,33.66 30,33.97 29.84,34.13 v29.84,36.67
  Bottom 0.254: v30.48,20.16 | v30.48,20.16 30.48,18.1 29.69,17.3 25.48,17.3 v24.45,16.27
FSMC_D4  (via drill 0.3)
  Top 0.254: IC1.38 27.3,28.1 v27.78,27.62 | v30.48,36.04 30.48,37.15 31.59,38.26 31.59,38.73 RN7.2
  Route15 0.254: v27.78,27.62 27.78,27.78 30.8,30.8 30.8,33.97 30.48,34.29 v30.48,36.04
FSMC_D5  (via drill 0.3)
  Top 0.254: IC1.39 26.8,31.89 27.78,32.86 30,32.86 34.45,37.31 34.45,38.26 34.77,38.58 35.72,38.58 v35.72,38.42 | v36.67,40.48 36.67,43.53 RN3.2
  Route15 0.254: v35.72,38.42 36.67,39.37 v36.67,40.48
FSMC_D6
  Top 0.254: IC1.40 26.3,32.02 27.62,33.34 29.84,33.34 33.97,37.47 33.97,38.42 34.61,39.05 36.35,39.05 37.31,40.01 37.31,44.03 RN3.3
FSMC_D7  (via drill 0.3)
  Top 0.254: IC1.41 25.8,27.85 26.67,26.99 v28.42,26.99 | v35.08,37.78 36.04,37.78 37.78,39.53 37.78,44.79 RN3.4
  Route15 0.254: v28.42,26.99 28.42,27.62 29.84,29.05 31.27,30.48 31.27,35.08 33.97,37.78 v35.08,37.78
FSMC_D8  (via drill 0.3)
  Top 0.254: IC1.42 25.3,31.5 v25.56,31.91 | v32.07,37.15 32.54,37.62 32.54,40.15 RN7.4
  Bottom 0.254: v25.56,31.91 27.15,31.91 28.57,33.34 29.37,33.34 32.07,36.04 v32.07,37.15
FSMC_D9  (via drill 0.3)
  Top 0.254: IC1.43 24.8,31.71 24.77,31.75 v24.65,31.95 | v33.34,38.42 33.34,40.69 RN6.1
  Bottom 0.254: v24.65,31.95 24.8,31.71 25.24,31.27 27.15,31.27 28.73,32.86 29.53,32.86 33.34,36.67 v33.34,38.42
FSMC_D10  (via drill 0.3)
  Top 0.254: IC1.44 24.3,31.26 23.65,31.91 23.65,36.04 23.97,36.35 v23.97,37.47 | v23.97,37.47 | v34.29,40.32 34.29,40.97 RN6.2
  Bottom 0.254: v23.97,37.47 24.13,37.62 28.42,37.62 30.8,40.01 33.97,40.01 v34.29,40.32
FSMC_D11  (via drill 0.3)
  Top 0.254: IC1.45 23.8,31.12 23.18,31.75 23.18,36.2 v23.18,36.67 | v23.18,36.67 | RN6.3 34.21,42.15 v34.92,41.59 | v34.92,41.59 | v34.92,41.59
  Bottom 0.254: v23.18,36.67 23.18,37.62 23.65,38.1 28.26,38.1 30.64,40.48 33.5,40.48 34.29,41.27 v34.92,41.59
FSMC_D12  (via drill 0.3)
  Top 0.254: IC1.46 23.3,30.99 22.7,31.59 22.7,35.56 v22.38,35.88 | RN6.4 35.56,42.07 35.56,40.96 v35.24,40.64
  Bottom 0.254: v22.38,35.88 23.5,35.88 24.77,37.15 28.57,37.15 30.96,39.53 34.45,39.53 35.24,40.32 v35.24,40.64
FSMC_D13  (via drill 0.3)
  Top 0.254: IC1.55 16.16,25.27 15.56,25.88 v14.45,25.88 | v35.56,39.69 36.04,40.16 36.04,42.7 35.49,43.25 RN3.1
  Bottom 0.254: v14.45,25.88 14.45,26.19 24.77,36.51 24.92,36.67 28.73,36.67 31.11,39.05 34.92,39.05 | 34.92,39.05 | 34.92,39.05 v35.56,39.69
FSMC_D14  (via drill 0.3)
  Top 0.254: IC1.56 15.87,24.77 15.64,25 v14.68,25 | RN4.1 26.28,35.02 v25.88,34.61
  Bottom 0.254: v14.68,25 | v14.68,25 15.08,25.4 15.08,25.56 15.08,26.19 22.86,33.97 25.24,33.97 v25.88,34.61 25.56,34.29
FSMC_D15  (via drill 0.3)
  Top 0.254: IC1.57 14.94,24.27 v14.76,24.13 | v26.04,33.66 27.15,34.77 27.15,35.54 RN4.2
  Bottom 0.254: v14.76,24.13 | v14.76,24.13 | v14.76,24.13 15.56,24.92 | 15.56,24.92 | 15.56,24.92 15.56,26.04 23.02,33.5 25.56,33.5 | 25.56,33.5 | 25.56,33.5 25.88,33.5 v26.04,33.66
FSMC_NADV  (via drill 0.3)
  Top 0.254: IC1.93 29.8,14.96 v29.21,15.56 | U1.P30 18.1,39.84 v18.1,39.37
  Route15 0.254: 29.37,15.4 v29.21,15.56 29.37,15.4 | 29.37,15.4 26.35,18.41 26.35,23.65 24.13,25.88 24.13,27.94 | 24.13,27.94 | 24.13,27.94 20.95,31.11 | v18.1,39.37 18.1,38.89 18.1,38.42 18.1,33.97 20.95,31.11 | 20.95,31.11
FSMC_NBL0  (via drill 0.3)
  Top 0.254: IC1.97 31.8,14.71 v31.11,15.72 | v31.11,15.72 | U1.P32 18.89,39.22 v18.89,38.58
  Route15 0.254: v31.11,15.72 | v31.11,15.72 30.48,16.35 29.05,16.35 26.83,18.57 26.83,23.81 24.61,26.04 24.61,29.84 22.86,31.59 21.11,31.59 18.57,34.13 18.57,37.94 18.89,38.26 v18.89,38.58
FSMC_NBL1  (via drill 0.3)
  Top 0.254: IC1.98 32.3,14.69 32.23,14.92 v31.59,16.51 | v19.84,37.31 19.53,37.78 19.53,39.15 U1.P33
  Route15 0.254: v31.59,16.51 31.27,16.83 29.21,16.83 27.3,18.73 27.3,23.97 25.08,26.19 25.08,30 23.02,32.07 | v19.84,37.31 19.68,37.15 19.21,36.67 19.21,35.4 19.21,34.13 21.27,32.07 23.02,32.07 | 23.02,32.07
FSMC_NE1  (via drill 0.3)
  Top 0.254: IC1.88 v27.3,15.72 | U1.P29 17.3,39.76 17.3,39.69 v17.3,38.73
  Route15 0.254: v27.3,15.72 27.3,16.83 25.88,18.26 25.88,23.5 23.65,25.72 23.65,27.78 20.8,30.64 17.62,33.81 | 17.62,33.81 | 17.62,33.81 17.62,34.45 17.62,38.26 17.62,38.42 v17.3,38.73
FSMC_NOE  (via drill 0.3)
  Top 0.254: IC1.85 25.8,12.15 v26.19,11.75 | U1.P26 17.02,41.59 v16.51,41.59
  Route15 0.254: v26.19,11.75 26.19,13.34 23.02,16.51 23.02,17.46 23.65,18.1 | 23.65,18.1 | 23.65,18.1 23.65,22.54 22.54,23.65 20.32,23.65 | 20.32,23.65 | 20.32,23.65 | 20.32,23.65 19.21,24.77 19.21,30.96 15.72,34.45 15.72,40.8 v16.51,41.59
FSMC_NWAIT  (via drill 0.3)
  Top 0.254: IC1.87 26.8,15.22 v26.35,15.72 | U1.P27 16.77,40.64 v16.51,40.64
  Route15 0.254: v26.35,15.72 26.35,16.51 24.13,18.73 24.13,22.7 22.7,24.13 20.48,24.13 19.68,24.92 19.68,31.11 16.35,34.45 | 16.35,34.45 | 16.35,34.45 | 16.35,34.45 | 16.35,34.45 16.35,40.48 v16.51,40.64 | v16.51,40.64
FSMC_NWE  (via drill 0.3)
  Top 0.254: U1.P70 40.16,46.62 40.16,45.24 39.69,44.77 38.89,44.77 38.26,44.13 38.26,39.37 36.04,37.15 v35.72,37.15 | IC1.86 26.3,14.49 v26.04,14.76
  Route15 0.254: v35.72,37.15 34.13,37.15 31.75,34.77 31.75,26.51 31.43,26.19 31.43,19.84 32.62,18.65 32.62,16.27 30.48,14.13 26.67,14.13 v26.04,14.76
GND  (via drill 0.3, 0.6)
  Top 0.254: v26.57,43.94 26.79,44.1 | C68.2 42.31,22.3 42.07,22.38 | U1.P77 37.04,57.38 C20.2 37.91,57.34 37.94,57.31 | U1.P113 19.02,66.36 v18.57,66.36 | U1.P69 37.15,48.93 v37.47,48.42 36.95,48.42 U1.P68 | LED4.C 38.58,2.38 | v28.56,59.44
  Top 0.305: U1.P25 19.38,44.66 v19.81,44.66 | U1.P13 14.73,48.5 14.97,48.58 15.4,48.58 v15.53,48.49 | v11.08,52.4 11.12,51.95 U1.P3 8.53,49.37 7.46,49.37 6.48,48.39 C21.2 | U1.P136 13.21,55.9 v13.21,55.43 | U1.P130 14.98,58.38 v14.98,57.93 | U1.P96 28.03,61.79 v28.03,60.73 | v28.56,59.44 28.65,59.53 29.3,59.53 29.84,60.07 U1.P91 32.7,62.93 32.7,63.34 33.66,64.29 33.75,64.29 C19.2 | U1.P64 32.04,50.51 30.5,50.51 30.48,50.48 v30.45,50.59 | U1.P54 29.36,46.12 v29.36,47.04 | U1.P49 27.51,44.43 27.13,44.43 26.79,44.1 26.79,43.73 U1.P47 | 18.73,10.95 18.73,13.65 17.94,14.45 17.94,15.4 18.31,15.77 IC1.74 20.85,15.77 v21.11,16.03 | C67.2 | 19.58,10.95 C43.2 | IC1.10 37.38,19.77 37.78,19.37 38,19.37 C40.2 38.1,19.21 | IC1.27 32.8,30.42 33.02,30.64 33.97,30.64 v33.97,30.48 | U1.P113 20.92,64.45 22.2,64.45 U1.P108 25.24,67.49 25.24,68.26 v25.08,68.42 | U1.P73 36.16,53.66 v35.4,53.66 | C18.2 10.21,42.59 10.16,42.55 v10.16,41.59
  Top 0.406: IC6.29 11.51,65.49 10.74,66.42 10.74,66.78 11.37,67.41 IC6.1 | IC6.21 8.97,62.31 9.53,62.87 | v3.97,17.62 4.01,17.62 C7.- | 6.35,46.99 6.48,46.99 C21.2 | v3.17,5.08 3.33,5.08 4.31,6.06 S2.P4 7.62,8.84 R1.1
  Top 0.61: RC1.1 | 10,32.7 R30.1 11.91,32.86 | 10,32.7 10,33.34 IC5.1 | 10,32.7 9.37,32.07 7.46,32.07 7.46,32.54 | 7.46,33.97 7.46,32.54 | 14.29,37.25 C34.2 14.29,36.99 14.61,36.51 14.29,36.51 12.54,38.26 v12.06,38.26 | C67.2 18.73,10.95 19.58,10.95 | C66.2 21.75,34.61 19.95,34.61 C42.2 19.84,34.45 | 19.84,34.45 | 19.84,34.45 v19.84,36.35 | C6.- v12.06,38.26 | v12.06,38.26 | 7.46,32.54 v7.14,32.86 | 42.48,2.38 42.7,2.38 | 42.48,2.38 LED1.C 42.77,2.38 44.29,2.38 | C68.2 42.19,22.35 42.04,22.35 | 42.04,22.35 42.23,22.23 | 42.04,22.35 42.23,22.38 42.55,22.7 v43.34,22.7 | C19.2 | C19.2 35.08,64.29 C30.2 36.67,62.71 36.67,62.64 C17.2 | v37.62,63.34 36.83,62.55 35.24,64.14 | v30.32,68.26 30.32,67.15 C15.2 | v5.4,46.04 5.71,46.35 6.35,46.99 | C59.2 36.35,12.38 36.35,13.34 v35.24,14.45 | R22.1 42.23,34.13 42.23,34.29 | 37.94,57.31 37.94,58.1 v38.18,58.34 | LED2.C 44.29,2.38 | 44.29,2.38 | 42.48,2.38 41.75,2.38 | 40.48,2.38 40.96,2.38 | 40.96,2.38 v40.96,0.95 | LED5.C 40.48,2.38 | 40.48,2.38 40.01,2.38 | 38.58,2.38 40.01,2.38 | 40.96,2.38 41.05,2.38 LED5.C | LED5.C 40.26,2.28 40.01,2.38 | LED5.C 41.12,2.38 41.75,2.38 | 41.75,2.38 | C60.2 40.32,18.52 v40.32,19.21 40.01,19.53 38.16,19.53 C40.2 | C43.2 v19.68,10
  Top 0.813: 7.46,33.97 IC5.3 7.46,35.4 6.83,36.04 5.71,36.04 4.45,34.77 4.45,33.18 RC1.1 4.29,32.86 4.29,34.23 CB1.2 | 3.49,16.19 3.37,16.07 C7.- 3.97,16.23 3.97,19.37 C8.- 3.17,19.37 v0.95,20.32 | v33.97,30.48 34.13,30.48 34.77,31.11 34.77,31.54 C41.2 36.36,31.59 C61.2 | 42.23,34.29 v42.23,33.18 SJ6.1
  Bottom 0.254: C24.2 | v11.43,64.93
  Bottom 0.305: 12.86,63.82 12.86,62.87 12.54,62.55 v11.43,62.55 | R7.1 30.64,29.69 30.96,29.69 | SJ3.2 10.32,64.93 v11.43,64.93 | R9.1 11.8,72.49 12.06,72.23 C24.2
  Bottom 0.406: Q2.2 31.43,48.9 31.55,48.9 32.04,49.55 v30.45,50.59 | C46.2 12.06,66.99 12.06,68.1 | 12.06,68.1 12.06,69.11 | 12.06,69.11 C45.2 | v11.59,68.1 12.06,68.1 | 12.06,68.1 | 12.06,69.11 C24.2 | 10.95,70.8 10.95,71.12 11.27,70.8 C24.2 | 18.26,10.48 R8.1 | X3.5 13.48,8.11 13.49,8.41 13.18,8.73 v12.38,8.73
  Bottom 0.61: Q3.2 28.01,23.27 27.94,23.18 v27.94,21.59 | 30.96,29.69 33.18,29.69 v33.97,30.48 | 15.88,59.69 15.88,58.9 15.57,58.57 v14.98,57.93 | 15.88,59.69 15.88,61.28 15.88,61.12 C29.2 15.88,61.33 15.88,62.23 16.51,62.87 C16.2 | C12.2 26.51,42.7 26.51,43.97 26.6,44.13 v26.57,43.94 | C27.2 30.08,50.96 v30.45,50.59 | C28.2 26.19,47.62 23.65,45.09 22.78,45.09 IC4.4 19.95,44.53 v19.81,44.66 | 22.86,53.02 22.86,54.51 C11.2 | C26.2 15.93,59.75 15.88,59.69 | 31.39,48.9 Q2.2 | v35.24,14.45 34.92,14.13 SJ1.1 | SJ1.1 | R8.1 18.26,10.64 18.89,10 v19.68,10
  Bottom 0.813: 22.23,53.02 IC4.2 IC4.4 | 22.23,53.02 C47.2 | 22.23,53.02 22.86,53.02 C48.2 | v7.46,35.72 7.46,36.67 JP4.3 JP4.4 | 26.99,9.84 C56.2 26.99,9.74 R10.1 26.99,7.62 26.67,7.3 JP11.5 JP11.3 29.21,9.53 28.95,9.79 R14.1
  other vias: 9.53,63.66 9.84,67.31 2.54,23.02 12.07,37.15
  pour GND (isolate 0.254, rank 6): -2.54,76.83 47.62,76.83 47.62,-1.27 -1.91,-1.27
  pour Top (isolate 0.305, rank 6): 9.84,74.61 13.97,74.61 13.97,68.9 12.7,67.63 12.7,61.91 12.06,61.28 8.89,61.28 8.89,73.66
  pour Top (isolate 0.305, rank 6, no thermals): 3.17,14.61 9.21,14.61 9.84,15.24 9.84,29.53 15.24,34.92 15.24,40.96 14.92,41.27 12.86,41.27 11.27,42.86 8.89,42.86 8.1,42.07 3.17,42.07
  pour Bottom (isolate 0.254, rank 6): 18.73,42.86 20.95,40.64 27.62,40.64 28.89,41.91 32.07,41.91 32.38,42.23 32.38,51.75 26.04,58.1 17.46,58.1 15.24,55.88 15.24,47.62 18.73,44.13
  pour Bottom (isolate 0.305, rank 6): -0.64,-0.64 46.35,-0.64 46.35,74.93 9.84,74.93 9.84,61.12 9.05,60.33 -0.64,60.33
  pour Top (isolate 0.305, rank 6): -0.64,14.61 4.76,14.61 4.92,42.07 -0.64,42.07
GNDA  (via drill 0.3)
  Top 0.254: C63.2
  Top 0.305: 40.96,25.4 40.8,25.24 C65.2 40.81,24.77 | IC1.20 39.06,24.77 39.53,25.24 C64.2
  Top 0.406: C63.2 40.32,31.43
  Top 0.61: 41.44,25.08 C65.2 41.11,25.08 39.69,25.08 C64.2 | C63.2 40.32,31.27 40.32,30.64 40.32,29.69 40.22,29.58 C62.2 40.32,29.43 40.32,28.57 39.85,28.1 39.05,28.1 v38.73,27.78
  Top 0.813: 41.44,25.08 41.75,25.08 43.5,26.83 43.5,28.42 42.23,29.69 SJ6.2 40.37,30.59 40.32,30.64 | 40.32,30.64 C63.2 | 40.32,30.64
  Bottom 0.61: JP7.12 37.31,26.67 38.26,26.83 38.73,27.3 v38.73,27.78
INIT_B  (via drill 0.3)
  Top 0.254: U1.P39 26.19,38.67 26.19,38.26 25.08,37.15 v25.08,35.72 | IC1.36 28.3,30.53 28.89,31.11 v28.89,31.91
  Route15 0.254: v28.89,31.91 28.26,31.91 27.15,33.02 25.4,33.02 25.08,33.34 v25.08,35.72
N$1
  Top 0.61: R2.1 LED1.A
N$2
  Top 0.254: U1.P65 35.28,47.97 35.28,47.27 36.2,46.35 RN3.5
N$3
  Top 0.254: U1.P62 35.42,45.72 RN3.6
N$4  (via drill 0.3)
  Top 0.305: IC1.99 32.8,15.3 v32.86,15.4
  Bottom 0.305: v32.86,15.4 31.75,15.4 31.27,14.92 SJ1.2
N$5
  Top 0.254: U1.P61 35.05,45.37 RN3.7
N$6
  Top 0.254: U1.P59 34.43,44.58 RN3.8
N$7
  Top 0.254: U1.P58 33.51,44.8 33.51,44.34 33.77,44.08 RN6.5
N$8
  Top 0.254: U1.P57 32.95,44.65 32.95,43.55 33.15,43.35 RN6.6
N$9
  Top 0.254: U1.P56 32.39,44.5 32.39,42.99 32.58,42.8 RN6.7
N$10
  Top 0.254: U1.P51 30.92,42.43 31.6,42.43 RN6.8
N$11
  Top 0.254: U1.P50 31.25,41.4 RN7.5
N$12
  Top 0.254: U1.P48 30.46,40.78 RN7.6
N$13
  Top 0.254: U1.P46 29.18,40.64 29.58,40.64 30,40.21 RN7.7
N$14
  Top 0.254: U1.P45 29.49,39.62 RN7.8
N$15
  Top 0.254: U1.P44 28.42,39.99 28.42,38.1 28.89,37.62 28.89,37.15 28.83,37.09 RN4.5
N$16
  Top 0.61: LED3.C 4.82,49.63 4.76,49.69 4.76,51.75 R5.2
N$17
  Top 0.61: LED4.A R16.1
N$18
  Top 0.61: R3.1 LED2.A
N$19  (via drill 0.3)
  Top 0.254: IC1.8 32.58,18.77 v31.91,18.1
  Bottom 0.254: v31.91,18.1 30.16,16.35 26.04,16.35 22.23,12.54 18.41,12.54 18.26,12.54
  Bottom 0.406: R6.1 16.83,12.54 18.2,12.54 R8.2 18.36,12.6 18.41,12.54
N$20
  Top 0.305: U1.P144 8.53,54.93 8.1,54.93 7.78,54.61 R4.1
  Top 0.61: R5.1 6.67,53.66 7.62,53.66 R4.1
N$21
  Top 0.61: LED5.A R17.1
N$26
  Top 0.254: 42.23,36.67 42.23,36.41 R22.2
  Top 0.813: LED9.C 41.91,36.99 42.23,36.67 | 42.23,36.57 R22.2
N$33
  Top 0.61: LED10.C 9.53,10.16 R1.2
N$35
  Top 0.254: U1.P41 27.15,39.14 27.15,37.31 27.16,37.29 RN4.7
N$38
  Top 0.305: IC1.49 21.8,32.44 C66.1
N$39
  Top 0.305: IC1.73 18.02,16.27 17.46,15.72 C67.1
N$41  (via drill 0.3)
  Top 0.254: IC1.94 30.3,11.73 30.16,11.59 v30.15,11.5
  Bottom 0.254: v30.15,11.5 R14.2
N$42
  Bottom 0.813: X3.M4 X3.M1 10.65,1.76 10.79,1.91 19.39,1.91 X3.M2 X3.M3 19.64,7.66 19.68,7.62 24.45,7.62 R10.2 25.08,9.74 C56.1
N$44
  Top 0.254: U1.P43 27.94,39.76 27.94,37.15 27.96,37.13 RN4.6
N$45
  Top 0.254: U1.P40 26.67,38.91 26.67,37.94 26.28,37.55 RN4.8
N$51
  Top 0.61: CC1.2 RC1.2
N$52
  Top 0.61: CC1.1 4.6,26.99 5.87,26.99 6.19,27.3 IC5.5
N$53
  Top 0.813: L3.1 4.08,23.76 5.24,24.92 7.14,24.92 8.26,26.04 9.53,26.04 10,26.51 IC5.8
N$54
  Top 0.406: R30.2 11.74,31.28 10.79,31.27 6.51,31.27 5.87,31.91 5.87,33.02 6.19,33.34 IC5.4
  Top 0.61: R30.2 R27.1
N$55
  Top 0.406: L4.2 11.33,72.61 11.11,72.39 C23.1 9.84,70.8 C9.1 9.77,70.77 IC6.3
N$56  (via drill 0.3)
  Top 0.254: v32.23,20.8 32.41,20.77 IC1.12
  Bottom 0.254: v32.23,20.8 31.91,21.11 29.21,21.11 29.21,21.07 Q3.3
P1  (via drill 0.3)
  Top 0.254: U1.P1 8.07,50.32 7.14,50.32 5.56,48.74 4.92,48.1 v4.6,48.1
  Bottom 0.254: v4.6,48.1 4.6,47.94 3.65,46.99 JP2.22
P2  (via drill 0.3)
  Top 0.254: U1.P2 8.3,49.85 7.3,49.85 6.03,48.58 5.71,48.26 v5.71,47.94
  Bottom 0.254: v5.71,47.94 5.71,47.78 6.35,47.15 7.46,47.15 JP2.21
P5  (via drill 0.3)
  Top 0.254: 6.51,45.93 U1.P5 | 6.51,45.93 | 6.51,45.93 v6.51,45.72
  Bottom 0.254: v6.51,45.72 6.19,45.4 5.71,45.4 4.76,44.45 JP2.24
P6  (via drill 0.3)
  Top 0.254: U1.P6 7.94,46.65 7.62,46.34 v7.62,45.72
  Bottom 0.254: v7.62,45.72 JP2.23
P7  (via drill 0.3)
  Top 0.254: U1.P7 8.26,46.26 8.26,44.77 v6.83,43.34 | v6.83,43.34
  Bottom 0.254: v6.83,43.34 6.83,43.02 6.67,42.86 4.6,42.86 3.65,41.91 JP2.26
P8  (via drill 0.3)
  Top 0.254: U1.P8 8.73,46.03 8.73,44.45 7.78,43.5 v7.78,43.02
  Bottom 0.61: v7.78,43.02 7.78,42.07 JP2.25
P9  (via drill 0.3)
  Top 0.254: U1.P9 9.68,46.28 v9.68,45.72
  Route15 0.254: v5.87,30.32 6.19,30.32 9.84,33.97 | 9.84,33.97 | 9.84,33.97 9.84,36.51 9.84,37.94 9.84,39.69 8.41,41.12 8.41,43.97 9.68,45.24 v9.68,45.72
  Bottom 0.254: JP4.12 3.81,26.67 4.6,27.46 4.6,29.21 5.71,30.32 v5.87,30.32
P10  (via drill 0.3)
  Top 0.254: 9.05,43.97 v9.05,43.34 9.05,44.13 10.32,45.4 10.32,46.21 U1.P10
  Route15 0.254: v10.64,30.48 11.27,31.11 11.27,36.2 10.32,37.15 10.32,39.85 8.89,41.27 8.89,43.18 v9.05,43.34 | v9.05,43.34
  Bottom 0.254: v10.64,30.48 9.68,29.53 9.68,27.46 8.89,26.67 JP4.11
P11  (via drill 0.3)
  Top 0.254: v10,43.66 10,44.45 10.79,45.24 10.79,45.98 U1.P11
  Route15 0.254: v10.64,29.53 11.75,30.64 11.75,33.34 | 11.75,33.34 | 11.75,33.34 11.75,36.35 10.79,37.31 10.79,40.01 9.37,41.43 9.37,42.7 10,43.34 v10,43.66
  Bottom 0.254: v10.64,29.53 10.16,29.05 10.16,26.04 9.84,25.72 5.4,25.72 3.81,24.13 JP4.14
P12  (via drill 0.3)
  Top 0.254: U1.P12 11.43,45.9 11.43,44.93 v10.95,44.45 | v10.95,44.45
  Bottom 0.254: v10.95,44.45 10.95,43.81 12.7,42.07 12.7,35.88 10.32,33.5 5.56,33.5 3.81,31.75 JP4.8
P14  (via drill 0.3)
  Top 0.254: U1.P14 12.5,45.56 v12.06,45.56
  Bottom 0.254: v12.06,45.56 11.59,45.09 11.59,43.81 13.18,42.23 13.18,35.72 9.21,31.75 JP4.7 | v12.06,45.56
P15  (via drill 0.3)
  Top 0.254: U1.P15 12.22,44.58 v12.22,44.29
  Bottom 0.254: v12.22,44.29 12.22,43.81 13.65,42.39 13.65,35.56 9.68,31.59 9.68,31.11 9.53,30.96 5.56,30.96 3.81,29.21 JP4.10
P16  (via drill 0.3)
  Top 0.254: U1.P16 13.18,44.82 v13.18,44.45
  Bottom 0.254: v13.18,44.45 13.18,43.5 14.13,42.55 14.13,35.4 10.16,31.43 10.16,30.96 8.73,29.53 8.73,29.21 JP4.9
P17  (via drill 0.3)
  Top 0.254: U1.P17 15.56,46.49 v15.56,46.99
  Bottom 0.254: v15.56,46.99 15.56,44.29 14.61,43.34 14.61,43.18 14.61,32.23 14.61,28.89 9.84,24.13 JP4.13
P21  (via drill 0.3)
  Top 0.254: U1.P21 17.45,45.56 v17.78,45.56
  Bottom 0.254: v17.78,45.56 17.46,45.56 17.07,45.16 16.59,44.69 16.51,44.61 15.08,43.18 15.08,40.96 15.08,32.07 15.08,28.73 9.68,23.34 5.4,23.34 3.65,21.59 JP4.16 | v17.78,45.56
P22  (via drill 0.3)
  Top 0.254: U1.P22 17.52,44.93 v18.57,44.93
  Bottom 0.254: v18.57,44.93 18.57,44.77 18.89,44.45 18.89,43.02 21.11,40.8 21.11,36.2 21.11,34.61 21.11,33.5 9.21,21.59 JP4.15
P23  (via drill 0.3)
  Top 0.254: U1.P23 17.6,44.29 v17.94,44.29
  Bottom 0.254: v17.94,44.29 18.1,44.29 18.41,43.97 18.41,42.86 20.64,40.64 20.64,33.66 9.84,22.86 5.56,22.86 4.6,21.91 4.6,20 3.65,19.05 JP4.18
P34  (via drill 0.3)
  Top 0.254: U1.P34 21.57,40.48 v21.91,40.48
  Bottom 0.254: v21.91,40.48 21.91,39.37 22.23,39.05 27.94,39.05 30.32,41.43 33.18,41.43 34.92,43.18 39.69,43.18 40.64,42.23 40.64,30.48 41.91,29.21 JP7.9
P35  (via drill 0.3)
  Top 0.254: U1.P35 20.32,38.53 20.32,37.94 20.8,37.47 v22.38,37.47
  Bottom 0.254: v22.38,37.47 23.5,38.58 28.1,38.58 30.48,40.96 33.34,40.96 34.61,42.23 35.72,42.23 36.04,41.91 36.04,41.27 36.2,41.12 39.85,41.12 40.16,40.8 40.16,30.16 39.21,29.21 JP7.10
P38  (via drill 0.3)
  Top 0.254: U1.P38 24.16,40.01 v23.65,40.01
  Bottom 0.254: v23.65,40.01 24.13,39.53 27.78,39.53 30.16,41.91 33.02,41.91 34.77,43.66 39.85,43.66 41.12,42.39 41.12,32.54 41.91,31.75 JP7.7
P66  (via drill 0.3)
  Top 0.254: U1.P66 36.97,46.99 38.26,46.99 38.58,46.67 v38.58,45.56
  Route15 0.254: v38.58,45.56 38.58,42.23 39.53,41.27 40.01,41.27 40.48,40.8 40.48,33.97 v39.37,32.86
  Bottom 0.61: JP7.8 38.89,31.75 39.37,32.23 v39.37,32.86
P67  (via drill 0.3)
  Top 0.254: U1.P67 37.2,47.47 38.58,47.47 39.53,46.51 v39.53,45.56
  Route15 0.254: v41.27,43.34 41.27,37.47 v43.34,35.4
  Bottom 0.254: v39.53,45.56 40.32,45.56 41.12,44.77 41.12,43.5 v41.27,43.34 | v43.34,35.4 43.34,34.45 JP7.5
P74  (via drill 0.3)
  Top 0.254: U1.P74 37.35,55.56 38.58,55.56 39.69,54.45 39.69,48.58 41.91,46.35 41.91,41.75 39.53,39.37 v39.53,38.26
  Bottom 0.254: JP7.4 38.73,36.83 39.53,37.62 v39.53,38.26
P75  (via drill 0.3)
  Top 0.254: U1.P75 37.12,56.04 38.73,56.04 40.16,54.61 40.16,54.45 40.16,48.74 42.39,46.51 42.39,41.59 40.16,39.37 40.16,37.94 39.69,37.47 39.69,35.72 v39.53,35.56
  Bottom 0.254: JP7.6 38.73,34.29 39.53,35.08 v39.53,35.56
P78  (via drill 0.3)
  Top 0.254: U1.P78 38.34,59.37 40.48,59.37 40.96,58.9 40.96,48.58 42.86,46.67 42.86,41.43 41.91,40.48 41.91,38.42 v42.23,38.1
  Bottom 0.254: v42.23,38.1 42.23,37.47 42.55,37.15 42.86,37.15 JP7.3
P79  (via drill 0.3)
  Top 0.254: U1.P79 38.1,59.85 40.8,59.85 41.43,59.21 41.43,48.74 43.34,46.83 43.34,44.45 43.34,40.96 v42.86,40.48
  Bottom 0.254: v42.86,40.48 42.86,39.85 JP7.1
P80  (via drill 0.3)
  Top 0.254: U1.P80 37.87,60.33 40.96,60.33 41.91,59.37 41.91,52.07 v43.34,50.64
  Bottom 0.254: v43.34,50.64 43.34,49.69 JP5.19
P81  (via drill 0.3)
  Top 0.254: U1.P81 37.64,60.8 41.12,60.8 42.39,59.53 42.39,52.23 43.34,51.28 43.97,51.28 v44.29,50.96
  Bottom 0.254: v44.29,50.96 43.97,51.28 41.12,51.28 39.37,49.53 JP5.20
P82  (via drill 0.3)
  Top 0.254: U1.P82 37.41,61.28 41.27,61.28 42.86,59.69 42.86,53.34 v43.02,53.18
  Bottom 0.254: v43.02,53.18 43.02,52.23 JP5.17
P83  (via drill 0.3)
  Top 0.254: U1.P83 37.18,61.75 41.43,61.75 43.34,59.85 43.34,54.13 v43.97,53.5
  Bottom 0.254: v43.97,53.5 43.66,53.82 41.12,53.82 39.37,52.07 JP5.18
P84  (via drill 0.3)
  Top 0.254: U1.P84 32.07,57.35 v32.07,56.67
  Route15 0.254: v32.07,56.67 39.21,56.67 | 39.21,56.67 | 39.21,56.67 39.37,56.52 v39.85,56.04
  Bottom 0.254: v39.85,56.04 40.48,56.04 41.91,54.61 JP5.15
P85  (via drill 0.3)
  Top 0.254: U1.P85 33.86,59.85 v34.29,59.85
  Bottom 0.254: v34.29,59.85 | v34.29,59.85 | JP5.16 36.83,54.61 35.72,55.72 35.72,58.42 v34.29,59.85
P87  (via drill 0.3)
  Top 0.254: U1.P87 31.18,58.58 v30.64,58.58
  Route15 0.254: v30.64,58.58 36.99,58.58 37.47,59.05 38.58,59.05 v39.05,58.58
  Bottom 0.254: v39.05,58.58 39.05,58.42 39.53,57.94 41.27,57.94 42.07,57.15 JP5.13
P88  (via drill 0.3)
  Top 0.254: U1.P88 32.69,60.8 v33.02,60.8
  Bottom 0.254: v33.02,60.8 | v33.02,60.8 33.18,60.96 34.77,60.96 35.4,60.33 35.4,59.37 37.47,57.31 37.94,57.31 JP5.14
P92  (via drill 0.3)
  Top 0.254: U1.P92 32.23,63.16 32.23,63.66 34.13,65.56 36.35,65.56 37.62,64.29 39.37,64.29 39.69,63.98 v39.69,63.5
  Bottom 0.254: v39.69,63.5 40.64,63.5 40.96,63.18 40.96,60.64 41.75,59.85 43.02,59.85 JP5.11
P93  (via drill 0.3)
  Top 0.254: U1.P93 31.75,63.4 31.75,63.98 33.81,66.04 36.67,66.04 37.94,64.77 39.69,64.77 40.32,64.14 v40.32,62.55
  Bottom 0.254: v40.32,62.55 40.32,60.64 39.37,59.69 JP5.12
P94  (via drill 0.3)
  Top 0.254: U1.P94 31.27,63.62 31.27,64.14 33.69,66.52 36.99,66.52 38.26,65.25 40.48,65.25 v40.96,64.77
  Bottom 0.254: v40.96,64.77 40.96,63.98 42.7,62.23 JP5.9
P95  (via drill 0.3)
  Top 0.254: U1.P95 30.8,63.86 v30.8,64.61
  Bottom 0.254: v30.8,64.61 31.11,64.93 34.13,64.93 36.83,62.23 JP5.10
P97  (via drill 0.3)
  Top 0.254: U1.P97 29.5,63.98 v30,63.98
  Bottom 0.254: v30,63.98 30,64.77 30.64,65.41 34.92,65.41 36.04,66.52 40.16,66.52 41.91,64.77 JP5.7
P98  (via drill 0.3)
  Top 0.254: U1.P98 30.07,65.25 31.75,65.25 33.5,66.99 37.47,66.99 v38.58,65.88
  Bottom 0.254: 38.26,64.77 JP5.8 38.58,65.25 v38.58,65.88
P99  (via drill 0.3)
  Top 0.254: v34.92,67.94 34.45,67.47 33.18,67.47 31.43,65.72 29.84,65.72 U1.P99
  Bottom 0.254: v34.92,67.94 35.4,68.42 39.69,68.42 40.8,67.31 JP5.5
P100  (via drill 0.3)
  Top 0.254: U1.P100 29.6,66.2 31.11,66.2 v33.18,68.26
  Bottom 0.254: v33.18,68.26 33.5,68.26 34.45,67.31 JP5.6
P101  (via drill 0.3)
  Top 0.254: U1.P101 28.26,65.56 v28.26,65.88
  Bottom 0.254: v28.26,65.88 29.53,65.88 32.54,68.9 40.01,68.9 40.96,69.85 JP5.3
P102  (via drill 0.3)
  Top 0.254: U1.P102 25.56,63.57 v25.56,63.18
  Route15 0.254: v25.56,63.18 27.15,63.18 v33.5,69.53
  Bottom 0.254: v33.5,69.53 33.81,69.85 JP5.4
P104  (via drill 0.3)
  Top 0.254: U1.P104 27.78,67.2 27.78,68.26 28.57,69.06 32.07,69.06 v32.54,69.53
  Bottom 0.254: v32.54,69.53 33.18,70.17 34.45,71.44 39.85,71.44 40.8,72.39 JP5.1
P105  (via drill 0.3)
  Top 0.254: U1.P105 27.3,67.44 27.3,68.42 28.42,69.53 31.59,69.53 v32.54,70.48
  Bottom 0.254: v32.54,70.48 32.7,70.48 34.61,72.39 JP5.2 | v32.54,70.48
P111  (via drill 0.3)
  Top 0.254: U1.P111 19.37,67.42 v19.37,67.79
  Bottom 0.254: v19.37,67.79 19.84,67.31 25.56,67.31 33.66,59.21 | 33.66,59.21 | 33.66,59.21 35.24,57.63 35.24,55.4 36.04,54.61 36.04,48.9 37.15,47.78 41.27,47.78 42.07,46.99 JP5.21
P112  (via drill 0.3)
  Top 0.254: U1.P112 19.25,66.83 v18.57,67.31
  Bottom 0.254: v18.57,67.31 18.73,67.15 19.21,66.83 24.45,66.83 25.4,66.83 33.66,58.58 | 33.66,58.58 33.5,58.74 | 33.66,58.58 | 33.66,58.58 34.77,57.47 34.77,53.34 35.56,52.55 35.56,48.74 37.31,46.99 JP5.22
P114  (via drill 0.3)
  Top 0.254: U1.P114 21.48,63.18 v21.91,63.18
  Bottom 0.254: v21.91,63.18 22.86,63.18 23.5,62.55 29.05,62.55 34.29,57.31 34.29,53.18 35.08,52.39 35.08,48.58 36.04,47.62 36.04,46.35 36.2,46.2 40.32,46.2 42.07,44.45 JP5.23
P115  (via drill 0.3)
  Top 0.254: U1.P115 21.41,62.55 v22.54,62.55
  Bottom 0.254: v22.54,62.55 23.02,62.07 28.89,62.07 33.81,57.15 33.81,53.02 34.61,52.23 34.61,48.42 35.56,47.47 35.56,46.2 36.99,44.77 37.15,44.77 37.47,44.45 JP5.24
P116  (via drill 0.3)
  Top 0.254: U1.P116 21.34,61.91 v21.91,61.91
  Route15 0.254: v33.18,53.82 33.5,53.82 34.13,54.45 38.42,54.45 40.32,52.55 40.32,45.09 39.53,44.29 39.53,42.39 v39.85,42.07
  Bottom 0.254: 32.54,57.79 28.73,61.59 22.23,61.59 v21.91,61.91 | 32.54,57.79 | 32.54,57.79 33.34,56.99 33.34,53.98 v33.18,53.82 | JP5.26 39.69,41.91 v39.85,42.07
P117  (via drill 0.3)
  Top 0.254: U1.P117 21.27,61.28 v21.11,61.28
  Route15 0.254: v31.43,54.61 32.38,54.61 33.18,55.4 38.73,55.4 41.27,52.86 41.27,45.09 43.18,43.18 v44.13,43.18
  Bottom 0.254: v21.11,61.28 21.27,61.12 24.61,61.12 31.11,54.61 v31.43,54.61 | v44.13,43.18 44.13,42.55 43.81,42.23 43.5,42.23 JP5.25
P118  (via drill 0.3)
  Top 0.254: U1.P118 20.4,61.44 v20.48,60.64 | v40.48,43.97 40.48,40.96 40.01,40.48 v39.53,40.48
  Route15 0.254: v31.91,53.82 32.23,53.82 33.34,54.93 38.58,54.93 40.8,52.7 40.8,44.29 v40.48,43.97
  Bottom 0.254: v20.48,60.64 24.45,60.64 31.27,53.82 v31.91,53.82 | v39.53,40.48 39.53,39.05 39.21,39.37 JP7.2
P119  (via drill 0.3)
  Top 0.254: U1.P119 19.21,61.92 v19.21,61.28
  Bottom 0.254: 19.21,60.96 v19.21,61.28 19.21,60.48 15.72,56.99 | 15.72,56.99 | 15.72,56.99 15.4,56.67 14.29,56.67 11.75,59.21 10.16,59.21 9.68,58.74 5.4,58.74 4.45,59.69 JP2.12
P120  (via drill 0.3)
  Top 0.254: U1.P120 18.41,62.01 v18.41,61.75
  Bottom 0.254: v18.41,61.75 18.41,60.33 15.24,57.15 14.45,57.15 11.91,59.69 JP2.11
P134  (via drill 0.3)
  Top 0.254: 10.79,58.74 v10.64,58.58 10.95,58.9 11.63,58.9 U1.P134
  Bottom 0.254: v10.64,58.58 10.16,58.1 4.76,58.1 3.81,57.15 JP2.14
P137  (via drill 0.3)
  Top 0.254: U1.P137 12.22,56.18 v12.22,55.24
  Bottom 0.254: v12.22,55.24 10.32,57.15 JP2.13
P138  (via drill 0.3)
  Top 0.254: U1.P138 10.07,57.63 6.67,57.63 5.56,56.52 4.92,56.52 v4.29,55.88
  Bottom 0.254: v4.29,55.88 4.29,55.24 3.65,54.61 JP2.16
P139  (via drill 0.3)
  Top 0.254: U1.P139 9.84,57.15 6.83,57.15 5.56,55.88 v5.24,55.88
  Bottom 0.254: v5.24,55.88 5.24,55.72 6.19,54.77 7.46,54.77 JP2.15
P140  (via drill 0.3)
  Top 0.254: U1.P140 9.61,56.67 6.99,56.67 4.29,53.98 | 4.29,53.98 | 4.29,53.98 3.33,53.02 2.7,53.02 v2.54,53.18
  Bottom 0.254: v2.54,53.18 JP2.18
P141  (via drill 0.3)
  Top 0.254: U1.P141 10.79,54.78 v10.79,54.45
  Bottom 0.254: v10.79,54.45 10.79,53.98 8.89,52.07 JP2.17
P142  (via drill 0.3)
  Top 0.254: U1.P142 8.83,56.04 6.99,56.04 3.02,52.07 3.02,50.8 v2.86,50.64
  Bottom 0.254: v2.86,50.64 2.86,49.85 JP2.20
P143  (via drill 0.3)
  Top 0.254: U1.P143 8.6,55.56 7.14,55.56 3.81,52.23 v3.81,50.96
  Bottom 0.254: v3.81,50.96 4.13,50.64 5.4,50.64 6.51,49.53 JP2.19
PA0  (via drill 0.3)
  Top 0.254: IC1.23 34.53,26.27 v33.73,25.64